# Altium schematic sheet FFC_ToHDR_Sch.SchDoc: FFC_ToHDR
size 127 x 101 mm; Author: Hom; CompanyName: KitSprout; DrawnBy: Hom; Engineer: Hom; Organization: KitSprout; Revision: A; SheetNumber: 1; SheetTotal: 1; Version: 2.0; LibVersion: 1.9
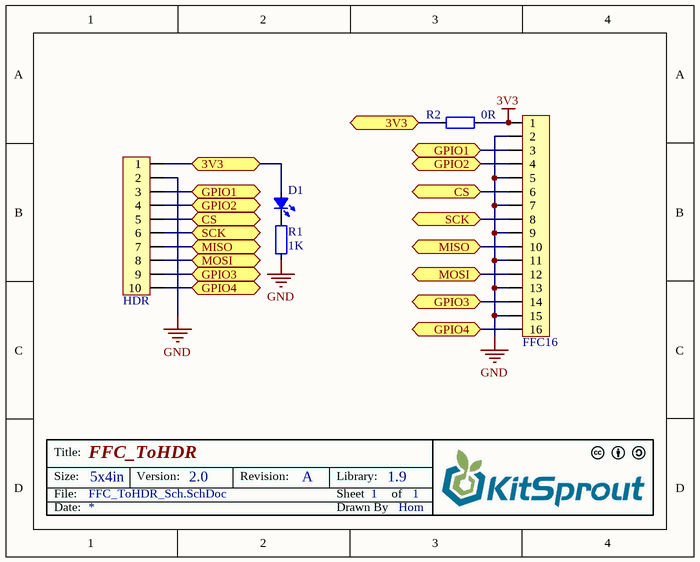
[diagram p0: FFC_ToHDR_Sch.SchDoc]

## Parts
D1  LED_0603  [LED_0603_BLUE]  (value not drawn)
FFC16  FFC_0.5_16  [FFC_0.5_16]  (value not drawn)
HDR  HDR1x10_2.54T  [HDR1X10_2.54_180H]  (value not drawn)
R1  value 1K  [RES_0603]  (hidden comment: Res_0603)
R2  value 0R  [RES_0805]  (hidden comment: Res_0805)

## Ports
3V3, CS, GPIO1, GPIO2, GPIO3, GPIO4, MISO, MOSI, SCK

## Nets
3V3: FFC16.1 R2.1
GND: FFC16.2 FFC16.5 FFC16.7 FFC16.9 FFC16.11 FFC16.13 FFC16.15 HDR.2 R1.1
3V3: D1.1(A) HDR.1 R2.2 ; port 3V3  [a separate net that carries the same name]
CS: FFC16.6 HDR.5 ; port CS
GPIO1: FFC16.3 HDR.3 ; port GPIO1
GPIO2: FFC16.4 HDR.4 ; port GPIO2
GPIO3: FFC16.14 HDR.9 ; port GPIO3
GPIO4: FFC16.16 HDR.10 ; port GPIO4
MISO: FFC16.10 HDR.7 ; port MISO
MOSI: FFC16.12 HDR.8 ; port MOSI
SCK: FFC16.8 HDR.6 ; port SCK
NetD1_2: D1.2(K) R1.2

## Notes on the sheet
- Title:
- Size:
- Date:
- File:
- 5x4in
- Version:
- Revision:
- Sheet
- Drawn By
- Library:
- of

## Library data of the parts
D1 = LED_0603: LED
FFC16 = FFC_0.5_16: FFC
HDR = HDR1x10_2.54T: Header
R1 = Res_0603: Resistor
R2 = Res_0805: Resistor